# EAGLE design noise generator (EAGLE 6.4)
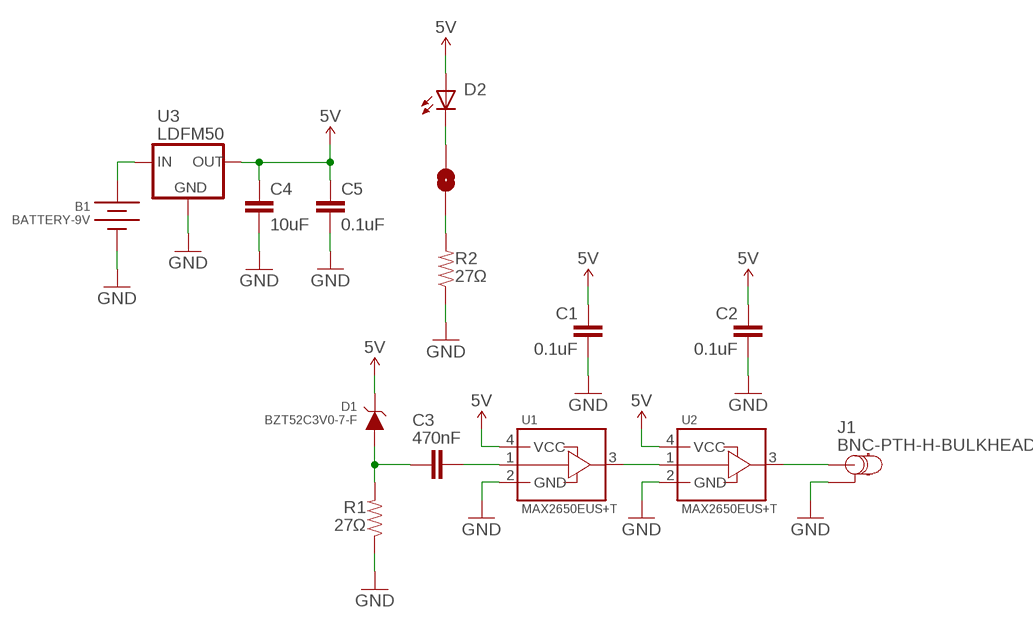
[diagram p0: schematic, sheet 1]

## Parts
B1  BATTERY-9V  [9V-NEG]
C1  0.1uF  CAP-1206  [1206]
C2  0.1uF  CAP-1206  [1206]
C3  470nF  CAP-1206  [1206]
C4  10uF  CAP-1206  [1206]
C5  0.1uF  CAP-1206  [1206]
D1  BZT52C3V0-7-F  [SOD123]
D2  LED-0805  [0805-LED]
J1  BNC-PTH-H-BULKHEAD  [BNC-5-1634556-0]
R1  27Ω  RESISTOR-1206  [1206]
R2  27Ω  RESISTOR-1206  [1206]
SJ1  SOLDERJUMPERNO  [SJ_2S-NO]
U1  MAX2650EUS+T  [SOT-143-4]
U2  MAX2650EUS+T  [SOT-143-4]
U3  LDFM50  [DPAK]

## Nets
5V: C1.1 C2.1 C4.1 C5.1 D1.CATHODE(C) D2.A U1.4(VCC) U2.4(VCC) U3.3(OUT)
GND: B1.N1(N) B1.N2(N) B1.N3(N) C1.2 C2.2 C4.2 C5.2 J1.P$1(GND) J1.P$2(GND) J1.P$3(GND) J1.P$4(GND) R1.1 R2.1 U1.2(GND) U2.2(GND) U3.TAB(GND)
N$1: C3.1 D1.ANODE(A) R1.2
N$2: U1.3(OUT) U2.1(IN)
N$3: C3.2 U1.1(IN)
N$4: J1.1(SIGNAL) U2.3(OUT)
N$5: R2.2 SJ1.1
N$6: B1.P1(P) B1.P2(P) B1.P3(P) U3.1(IN)
N$7: D2.C SJ1.2

## Library data of the parts
B1 = Connectors:BATTERY
C1-C5 = Passives:CAP
D1 = Diodes:BZT52C
D2 = Passives:LED
J1 = Connectors:BNC
R1 R2 = Passives:RESISTOR
SJ1 = SparkFun-Passives:SOLDERJUMPER: Solder Jumper Standard SMD solder jumper. Used to automate production. Two varients : Normally Open and Normally Closed are the same, but have different paste layers. NC will have a large amount of paste and should jumper during reflow.
U1 U2 = Maxim:MAX2650
U3 = STMicroelectrionics:LDFM50

## Board
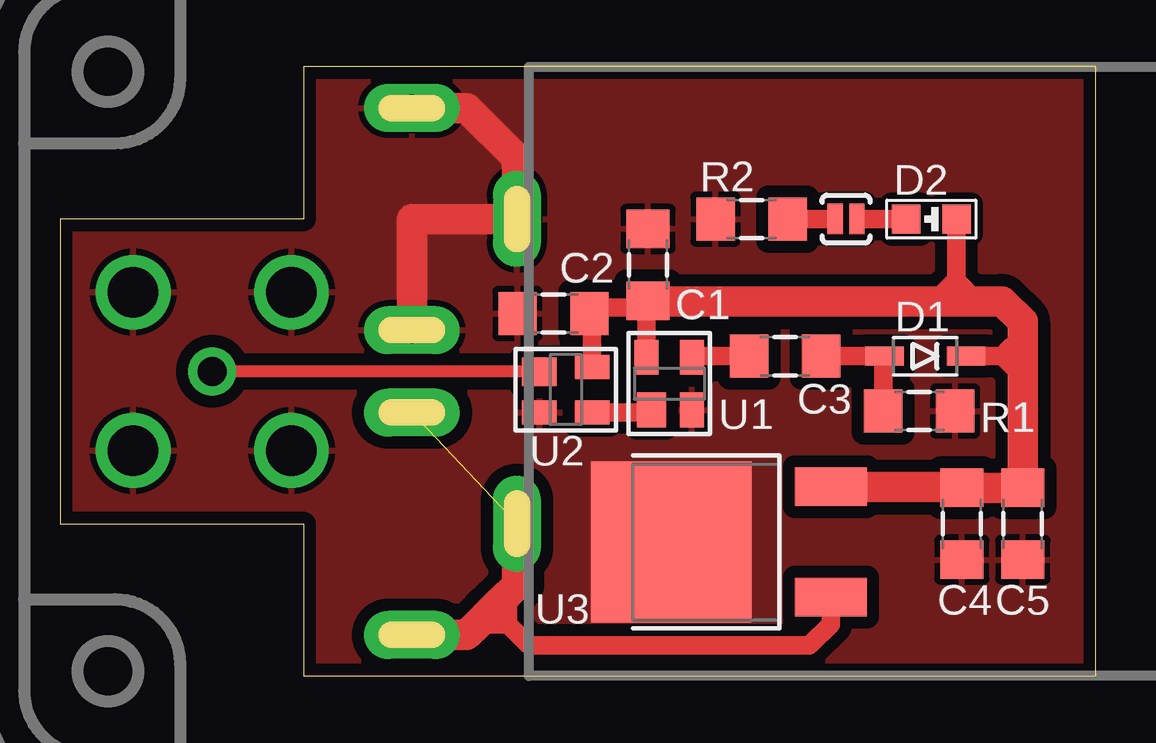
[diagram p1: board, top side]
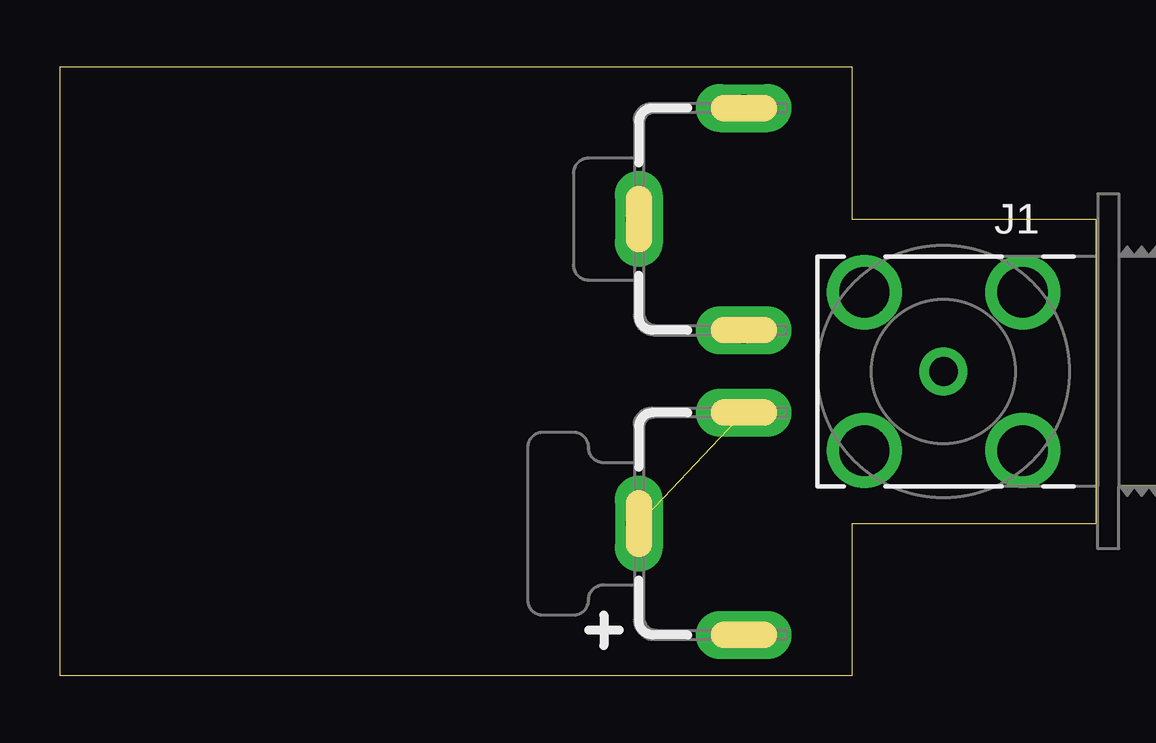
[diagram p2: board, bottom side, seen from below]

Size 43.18 x 25.4 mm. Coordinates in mm from the lower left corner, seen from the top.
Outline: 10.16,0 43.18,0 43.18,25.4 10.16,25.4 10.16,19.05 0,19.05 0,6.35 10.16,6.35 10.16,0
Copper layers (1*16): Top 0.0356mm / dielectric 1.5011mm / Bottom 0.0356mm
Design rules "oshpark-2layer": minimum track width 6mil, minimum drill 13mil, track to track 6mil, track to pad 6mil, pad to pad 6mil, via to via 6mil, smd to smd 6mil, copper to edge 15mil, drill to drill 6mil, minimum pad ring 7mil, minimum via ring 7mil, stop-mask expansion 4mil, vias tented up to drill 0mil, thermal gap 10mil

### Footprints (pad centres in the part's own frame; a part is rotated, then mirrored left to right if it is on the bottom)
9V-NEG = drill 1.1 pad 2 long: N1 -1.715,4.38; N2 -6.35,0; N3 -10.985,4.38; P1 10.985,4.38; P2 6.35,0; P3 1.715,4.38
1206 = smd 1.6 x 1.8: 1 -1.5,0; 2 1.5,0
SOD123 = smd 1.6 x 0.8: ANODE 1.7,0; CATHODE -1.7,0
0805-LED = smd 1.2 x 1.2: A -1.05,0; C 1.05,0
BNC-5-1634556-0 = drill 1.2 pad 2: 1 0,0 | drill 2.1 pad 3: P$1 -3.3,-3.3; P$2 -3.3,3.3; P$3 3.3,3.3; P$4 3.3,-3.3
SJ_2S-NO = smd 0.635 x 1.27: 1 -0.45,0; 2 0.45,0
SOT-143-4 = smd 1.44 x 1: 1 -1.1,0.95; 2 1.1,0.95; 4 -1.1,-0.95 | smd 1.44 x 1.2: 3 1.1,-0.75
DPAK = smd 1.6 x 3: 1 -2.3,-4.7; 3 2.3,-4.7 | smd 6.7 x 6.7: TAB 0,1.95

### Placement (x,y rotation side)
B1  19.05,12.7 270 bottom
C1  24.51,17.14 90 top
C2  20.57,15.11 180 top
C3  30.23,13.34 180 top
C4  37.59,6.35 270 top
C5  40.13,6.35 270 top
D1  36.07,13.34 180 top
D2  36.32,19.05 180 top
J1  6.35,12.7 180 bottom
R1  35.81,11.05 180 top
R2  28.83,19.05 0 top
SJ1  32.77,19.05 0 top
U1  25.4,12.19 270 top
U2  21.08,11.94 180 top
U3  27.43,5.59 90 top

### Tracks (layer width: path | path; a pad name or v marks a point on that pad's centre or on a via)
5V
  Top 0.762: U1.4 24.45,15.58 C1.1 24.15,15.64 24.38,15.62 24.13,15.37 22.33,15.37 C2.1 22.18,15.01 U2.4 | D1.CATHODE 39.62,13.34 | D2.A 37.37,15.62 37.21,15.62 | 36.45,15.62 37.34,16.51 38.23,15.62
  Top 1.27: U3.3 37.55,7.89 C4.1 C5.1 40.13,12.83 | 40.13,12.83 39.62,13.34 40.13,13.84 | 24.38,15.62 36.45,15.62 37.21,15.62 38.23,15.62 39.28,15.62 40.13,14.77 40.13,13.84 | 40.13,13.84 40.13,12.83
GND
  Top 1.27: B1.N3 16.95,23.68 19.05,21.59 B1.N2 14.67,19.05 B1.N1
  pour Top (isolate 0.508): -1.27,26.67 44.45,26.67 44.45,-1.27 -1.27,-1.27
  pour Top (isolate 0.508, no thermals): 21.59,9.27 21.59,1.91 29.97,1.91 29.97,9.4
N$1
  Top 0.762: D1.ANODE 34.31,13.34 | 34.31,13.34 C3.1 | R1.2 34.31,13.34
N$2
  Top 0.762: U2.1 24.55,10.99 U1.3
N$3
  Top 0.762: C3.2 26.39,13.34 U1.1
N$4
  Top 0.508: U2.3 6.36,12.69 J1.1
N$5
  Top 0.254: 32,19.05 SJ1.1
  Top 0.762: R2.2 32,19.05
N$6  (1 unrouted)
  Top 0.762: U3.1 32.13,2.16 31.24,1.27 19.56,1.27 18.67,2.16 | 18.67,2.16 18.03,2.79 | 18.67,2.16 18.67,3.43 | 18.67,2.16 17.4,2.16
  Top 1.27: B1.P1 16.95,1.72 17.4,2.16 18.03,2.79 18.67,3.43 19.05,3.81 B1.P2
N$7
  Top 0.254: 33.4,19.05 SJ1.2
  Top 0.762: D2.C 33.4,19.05

### Text on the board
tDocu: 9V Battery